# Altium schematic sheet 10_Gbit_Ethernet.SchDoc: Gbit_Ethernet
size 420 x 297 mm; Author: Lukas Henkel; DocumentNumber: 10; SheetNumber: 10; SheetTotal: 16; DocSize: A3
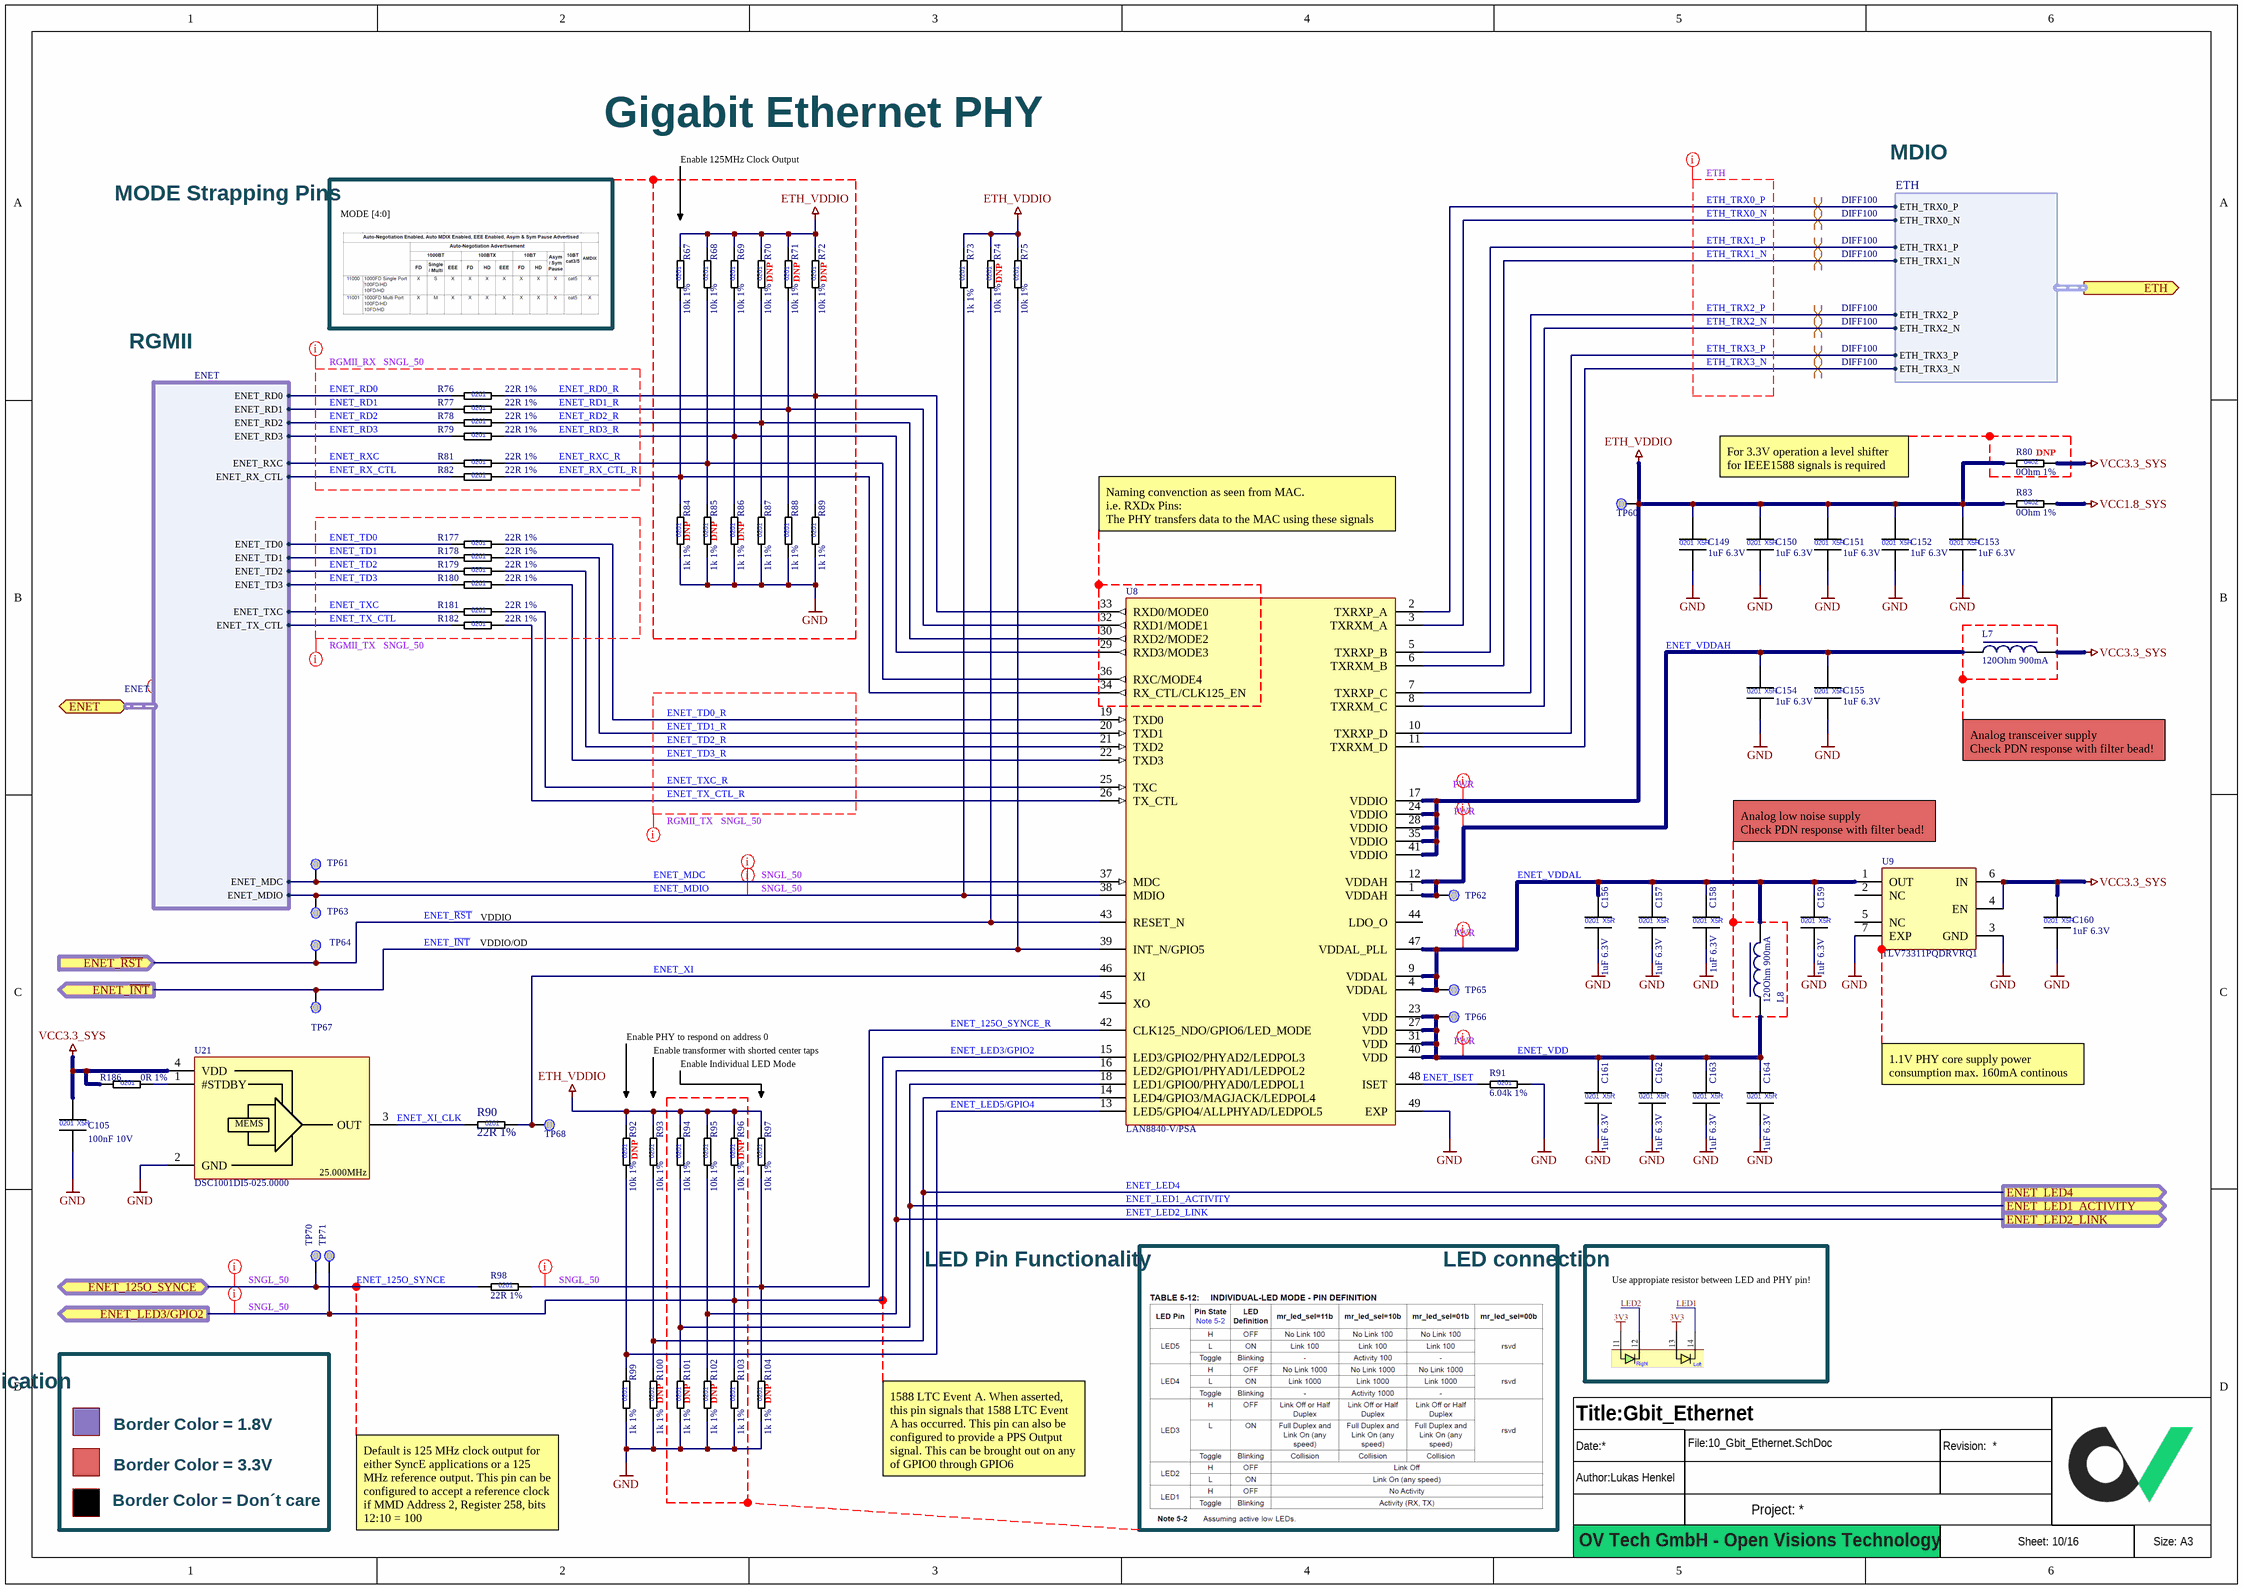
[diagram p0: 10_Gbit_Ethernet.SchDoc]

## Parts
?  (no value)  (graphical)
C105  100nF 10V  [CAPC0603X03L]
C149  1uF 6.3V  [CAPC0603X03L]
C150  1uF 6.3V  [CAPC0603X03L]
C151  1uF 6.3V  [CAPC0603X03L]
C152  1uF 6.3V  [CAPC0603X03L]
C153  1uF 6.3V  [CAPC0603X03L]
C154  1uF 6.3V  [CAPC0603X03L]
C155  1uF 6.3V  [CAPC0603X03L]
C156  1uF 6.3V  [CAPC0603X03L]
C157  1uF 6.3V  [CAPC0603X03L]
C158  1uF 6.3V  [CAPC0603X03L]
C159  1uF 6.3V  [CAPC0603X03L]
C160  1uF 6.3V  [CAPC0603X03L]
C161  1uF 6.3V  [CAPC0603X03L]
C162  1uF 6.3V  [CAPC0603X03L]
C163  1uF 6.3V  [CAPC0603X03L]
C164  1uF 6.3V  [CAPC0603X03L]
L7  120Ohm 900mA  [INDC0603X03L]
L8  120Ohm 900mA  [INDC0603X03L]
R67  10k 1%  [RESC0603X03L]
R68  10k 1%  [RESC0603X03L]
R69  10k 1%  [RESC0603X03L]
R70  10k 1%  [RESC0603X03L]
R71  10k 1%  [RESC0603X03L]
R72  10k 1%  [RESC0603X03L]
R73  1k 1%  [RESC0603X03L]
R74  10k 1%  [RESC0603X03L]
R75  10k 1%  [RESC0603X03L]
R76  22R 1%  [RESC0603X03L]
R77  22R 1%  [RESC0603X03L]
R78  22R 1%  [RESC0603X03L]
R79  22R 1%  [RESC0603X03L]
R80  0Ohm 1%  [RESC1005X04L]
R81  22R 1%  [RESC0603X03L]
R82  22R 1%  [RESC0603X03L]
R83  0Ohm 1%  [RESC1005X04L]
R84  1k 1%  [RESC0603X03L]
R85  1k 1%  [RESC0603X03L]
R86  1k 1%  [RESC0603X03L]
R87  1k 1%  [RESC0603X03L]
R88  1k 1%  [RESC0603X03L]
R89  1k 1%  [RESC0603X03L]
R90  22R 1%  [RESC0603X03L]
R91  6.04k 1%  [RESC0603X03L]
R92  10k 1%  [RESC0603X03L]
R93  10k 1%  [RESC0603X03L]
R94  10k 1%  [RESC0603X03L]
R95  10k 1%  [RESC0603X03L]
R96  10k 1%  [RESC0603X03L]
R97  10k 1%  [RESC0603X03L]
R98  22R 1%  [RESC0603X03L]
R99  1k 1%  [RESC0603X03L]
R100  1k 1%  [RESC0603X03L]
R101  1k 1%  [RESC0603X03L]
R102  1k 1%  [RESC0603X03L]
R103  1k 1%  [RESC0603X03L]
R104  1k 1%  [RESC0603X03L]
R177  22R 1%  [RESC0603X03L]
R178  22R 1%  [RESC0603X03L]
R179  22R 1%  [RESC0603X03L]
R180  22R 1%  [RESC0603X03L]
R181  22R 1%  [RESC0603X03L]
R182  22R 1%  [RESC0603X03L]
R186  0R 1%  [RESC0603X03L]
TP60  Testpoint 0.5mm  [TP_0.50mm]  (value not drawn)  (no BOM)
TP61  Testpoint 0.5mm  [TP_0.50mm]  (value not drawn)  (no BOM)
TP62  Testpoint 0.5mm  [TP_0.50mm]  (value not drawn)  (no BOM)
TP63  Testpoint 0.5mm  [TP_0.50mm]  (value not drawn)  (no BOM)
TP64  Testpoint 0.5mm  [TP_0.50mm]  (value not drawn)  (no BOM)
TP65  Testpoint 0.5mm  [TP_0.50mm]  (value not drawn)  (no BOM)
TP66  Testpoint 0.5mm  [TP_0.50mm]  (value not drawn)  (no BOM)
TP67  Testpoint 0.5mm  [TP_0.50mm]  (value not drawn)  (no BOM)
TP68  Testpoint 0.5mm  [TP_0.50mm]  (value not drawn)  (no BOM)
TP70  Testpoint 0.5mm  [TP_0.50mm]  (value not drawn)  (no BOM)
TP71  Testpoint 0.5mm  [TP_0.50mm]  (value not drawn)  (no BOM)
U8  LAN8840-V/PSA  [QFN50P700X700X100_HS-49L]
U9  TLV73311PQDRVRQ1  [SON65P200X80_HS-7L]
U21  DSC1001DI5-025.0000  [DFN165P250X90-4N]

## Blocks framed on the sheet
DNP: R80

## Ports
ENET (bidir, harness ENET), ENET_125O_SYNCE (bidir), ENET_LED1_ACTIVITY (out), ENET_LED2_LINK (out), ENET_LED3/GPIO2 (out), ENET_LED4 (out), ENET_~{INT} (out), ENET_~{RST} (in), ETH (out, harness ETH)

## Harnesses
ENET: ENET_MDC, ENET_MDIO, ENET_TX_CTL, ENET_TXC, ENET_TD0, ENET_TD1, ENET_TD2, ENET_TD3, ENET_RX_CTL, ENET_RXC, ENET_RD0, ENET_RD1, ENET_RD2, ENET_RD3
ETH: ETH_TRX0_P, ETH_TRX0_N, ETH_TRX1_N, ETH_TRX1_P, ETH_TRX2_P, ETH_TRX2_N, ETH_TRX3_P, ETH_TRX3_N

## Nets
ETH_VDDIO: C149.1 C150.1 C151.1 C152.1 C153.1 R67.2 R68.2 R69.2 R70.2 R71.2 R72.2 R73.2 R74.2 R75.2 R80.1 R83.1 R92.2 R93.2 R94.2 R95.2 R96.2 R97.2 TP60.TP U8.17(VDDIO) U8.24(VDDIO) U8.28(VDDIO) U8.35(VDDIO) U8.41(VDDIO)
GND: C105.2 C149.2 C150.2 C151.2 C152.2 C153.2 C154.2 C155.2 C156.2 C157.2 C158.2 C159.2 C160.2 C161.2 C162.2 C163.2 C164.2 R84.1 R85.1 R86.1 R87.1 R88.1 R89.1 R91.2 R99.1 R100.1 R101.1 R102.1 R103.1 R104.1 U8.49(EXP) U9.3(GND) U9.7(EXP) U21.2(GND)
VCC1.8_SYS: R83.2
VCC3.3_SYS: C105.1 C160.1 L7.2 R80.2 R186.1 U9.4(EN) U9.6(IN) U21.4(VDD)
ENET_125O_SYNCE: R98.1 TP70.TP ; port ENET_125O_SYNCE
ENET_125O_SYNCE_R: R97.1 R98.2 R104.2 U8.42(CLK125_NDO/GPIO6/LED_MODE)
ENET_~{INT}: R75.1 TP67.TP U8.39(INT_N/GPIO5) ; port ENET_~{INT}
ENET_ISET: R91.1 U8.48(ISET)
ENET_LED1_ACTIVITY: R94.1 R101.2 U8.18(LED1/GPIO0/PHYAD0/LEDPOL1) ; port ENET_LED1_ACTIVITY
ENET_LED2_LINK: R95.1 R102.2 U8.16(LED2/GPIO1/PHYAD1/LEDPOL2) ; port ENET_LED2_LINK
ENET_LED3/GPIO2: R96.1 R103.2 TP71.TP U8.15(LED3/GPIO2/PHYAD2/LEDPOL3) ; port ENET_LED3/GPIO2
ENET_LED4: R93.1 R100.2 U8.14(LED4/GPIO3/MAGJACK/LEDPOL4) ; port ENET_LED4
ENET_LED5/GPIO4: R92.1 R99.2 U8.13(LED5/GPIO4/ALLPHYAD/LEDPOL5)
ENET_MDC: TP61.TP U8.37(MDC) ; port ENET.ENET_MDC
ENET_MDIO: R73.1 TP63.TP U8.38(MDIO) ; port ENET.ENET_MDIO
ENET_~{RST}: R74.1 TP64.TP U8.43(RESET_N) ; port ENET_~{RST}
ENET_RD0: R76.1 ; port ENET.ENET_RD0
ENET_RD0_R: R72.1 R76.2 R89.2 U8.33(RXD0/MODE0)
ENET_RD1: R77.1 ; port ENET.ENET_RD1
ENET_RD1_R: R71.1 R77.2 R88.2 U8.32(RXD1/MODE1)
ENET_RD2: R78.1 ; port ENET.ENET_RD2
ENET_RD2_R: R70.1 R78.2 R87.2 U8.30(RXD2/MODE2)
ENET_RD3: R79.1 ; port ENET.ENET_RD3
ENET_RD3_R: R69.1 R79.2 R86.2 U8.29(RXD3/MODE3)
ENET_RX_CTL: R82.1 ; port ENET.ENET_RX_CTL
ENET_RX_CTL_R: R67.1 R82.2 R84.2 U8.34(RX_CTL/CLK125_EN)
ENET_RXC: R81.1 ; port ENET.ENET_RXC
ENET_RXC_R: R68.1 R81.2 R85.2 U8.36(RXC/MODE4)
ENET_TD0: R177.1 ; port ENET.ENET_TD0
ENET_TD0_R: R177.2 U8.19(TXD0)
ENET_TD1: R178.1 ; port ENET.ENET_TD1
ENET_TD1_R: R178.2 U8.20(TXD1)
ENET_TD2: R179.1 ; port ENET.ENET_TD2
ENET_TD2_R: R179.2 U8.21(TXD2)
ENET_TD3: R180.1 ; port ENET.ENET_TD3
ENET_TD3_R: R180.2 U8.22(TXD3)
ENET_TX_CTL: R182.1 ; port ENET.ENET_TX_CTL
ENET_TX_CTL_R: R182.2 U8.26(TX_CTL)
ENET_TXC: R181.1 ; port ENET.ENET_TXC
ENET_TXC_R: R181.2 U8.25(TXC)
ENET_VDD: C161.1 C162.1 C163.1 C164.1 L8.1 TP66.TP U8.23(VDD) U8.27(VDD) U8.31(VDD) U8.40(VDD)
ENET_VDDAH: C154.1 C155.1 L7.1 TP62.TP U8.1(VDDAH) U8.12(VDDAH)
ENET_VDDAL: C156.1 C157.1 C158.1 C159.1 L8.2 TP65.TP U8.4(VDDAL) U8.9(VDDAL) U8.47(VDDAL_PLL) U9.1(OUT)
ENET_XI: R90.2 TP68.TP U8.46(XI)
ENET_XI_CLK: R90.1 U21.3(OUT)
ETH_TRX0_N: U8.3(TXRXM_A) ; port ETH.ETH_TRX0_N
ETH_TRX0_P: U8.2(TXRXP_A) ; port ETH.ETH_TRX0_P
ETH_TRX1_N: U8.6(TXRXM_B) ; port ETH.ETH_TRX1_N
ETH_TRX1_P: U8.5(TXRXP_B) ; port ETH.ETH_TRX1_P
ETH_TRX2_N: U8.8(TXRXM_C) ; port ETH.ETH_TRX2_N
ETH_TRX2_P: U8.7(TXRXP_C) ; port ETH.ETH_TRX2_P
ETH_TRX3_N: U8.11(TXRXM_D) ; port ETH.ETH_TRX3_N
ETH_TRX3_P: U8.10(TXRXP_D) ; port ETH.ETH_TRX3_P
NetR186_2: R186.2 U21.1(#STDBY)

Not connected (* = marked no-connect by the designer): U8 44(LDO_O) 45(XO); U9 2(NC) 5(NC)

## Layout directives
net class ENET: (no net found under the mark)
net class ETH: ETH_TRX0_N, ETH_TRX0_P, ETH_TRX1_N, ETH_TRX1_P, ETH_TRX2_N, ETH_TRX2_P, ETH_TRX3_N, ETH_TRX3_P
differential pair; differential pair class DIFF100: ETH_TRX0_N, ETH_TRX0_P, ETH_TRX1_N, ETH_TRX1_P, ETH_TRX2_N, ETH_TRX2_P, ETH_TRX3_N, ETH_TRX3_P
net class RGMII_RX; net class SNGL_50; net class ENET: ENET_RD0, ENET_RD0_R, ENET_RD1, ENET_RD1_R, ENET_RD2, ENET_RD2_R, ENET_RD3, ENET_RD3_R, ENET_RX_CTL, ENET_RX_CTL_R, ENET_RXC, ENET_RXC_R
net class RGMII_TX; net class SNGL_50; net class ENET: ENET_TD0, ENET_TD0_R, ENET_TD1, ENET_TD1_R, ENET_TD2, ENET_TD2_R, ENET_TD3, ENET_TD3_R, ENET_TX_CTL, ENET_TX_CTL_R, ENET_TXC, ENET_TXC_R
net class SNGL_50: ENET_125O_SYNCE, ENET_125O_SYNCE_R, ENET_LED3/GPIO2, ENET_MDC, ENET_MDIO
net class PWR: ENET_VDD, ENET_VDDAH, ENET_VDDAL, ETH_VDDIO

## Notes on the sheet
- Gigabit Ethernet PHY
- MODE Strapping Pins
- Enable 125MHz Clock Output
- MDIO
- MODE [4:0]
- (near R70) DNP
- (near R71) DNP
- (near R72) DNP
- (near R74) DNP
- RGMII
- Naming convenction as seen from MAC.
  i.e. RXDx Pins:
  The PHY transfers data to the MAC using these signals
- For 3.3V operation a level shifter for IEEE1588 signals is required
- (near R84) DNP
- (near R85) DNP
- (near R86) DNP
- Analog transceiver supply
  Check PDN response with filter bead!
- (near U9) Analog low noise supply
  Check PDN response with filter bead!
- VDDIO
- VDDIO/OD
- Enable PHY to respond on address 0
- Enable transformer with shorted center taps
- Enable Individual LED Mode
- 1.1V PHY core supply power consumption max. 160mA continous
- (near R92) DNP
- (near R96) DNP
- LED Pin Functionality
- LED connection
- Use appropiate resistor between LED and PHY pin!
- Signal Level Indication
- (near R100) DNP
- (near R101) DNP
- (near R102) DNP
- (near R104) DNP
- Border Color = 1.8V
- Border Color = 3.3V
- 1588 LTC Event A. When asserted, this pin signals that 1588 LTC Event A has occurred. This pin can also be configured to provide a PPS Output signal. This can be brought out on any of GPIO0 through GPIO6
- Border Color = Don´t care
- Default is 125 MHz clock output for either SyncE applications or a 125 MHz reference output. This pin can be configured to accept a reference clock if MMD Address 2, Register 258, bits 12:10 = 100
- OV Tech GmbH - Open Visions Technology
- (in symbol CAP_0201_1uF_6.3V) 0201; X5R
- (in symbol CAP_0201_100nF_10V) 0201; X5R
- (in symbol MEMS Oscillator_Microchip_DSC1001DI5-025.0000) MEMS; 25.000MHz
- (in symbol RES_0201_0R_1%) 0201
- (in symbol RES_0201_1k_1%) 0201
- (in symbol RES_0201_6.04k_1%) 0201
- (in symbol RES_0201_10k_1%) 0201
- (in symbol RES_0201_22R_1%) 0201
- (in symbol RES_0402_0R_1%) 0402

## Library data of the parts
? = Titleblock_01_OpenSource
C105 = CAP_0201_100nF_10V: Multilayer Ceramic Capacitors MLCC - SMD/SMT 0201 10VDC; Manufacturer 1: Murata Electronics; Manufacturer 1 Prt. Nr.: GRT033R61A104KE01J; Manufacturer 2 Prt. Nr.: CL03A104MP3NNNC; Manufacturer 2: Samsung Electro-Mechanics
C149-C164 = CAP_0201_1uF_6.3V: Multilayer Ceramic Capacitors MLCC - SMD/SMT 0201 6.3VDC; Manufacturer 1: Murata Electronics; Manufacturer 1 Prt. Nr.: GRM033R60J105MEA2D; Manufacturer 2 Prt. Nr.: CL03A105MQ3CSNC; Manufacturer 2: Samsung Electro-Mechanics
L7 L8 = BEAD_0201_120Ohm_900mA: Ferrite Bead 0201 120Ohm 900mA; Manufacturer 1 Prt. Nr.: BLM03PX121SN1D; Manufacturer 1: Murata Electronics
R67-R72 R74 R75 R92-R97 = RES_0201_10k_1%: Thick Film Resistors - SMD 10K OHM 1%; Manufacturer 1: Yageo; Manufacturer 1 Prt. Nr.: RC0201FR-0710KL; Manufacturer 2 Prt. Nr.: CRCW020110K0FNED; Manufacturer 2: Vishay / Dale
R73 R84-R89 R99-R104 = RES_0201_1k_1%: Thick Film Resistors - SMD 1K OHM 1%; Manufacturer 1: Yageo; Manufacturer 1 Prt. Nr.: RC0201FR-071KL; Manufacturer 2 Prt. Nr.: CRCW02011K00FNED; Manufacturer 2: Vishay / Dale
R76-R79 R81 R82 R90 R98 R177-R182 = RES_0201_22R_1%: Thick Film Resistors - SMD 22R OHM 1%; Manufacturer 1: Yageo; Manufacturer 1 Prt. Nr.: RC0201FR-0722RL; Manufacturer 2 Prt. Nr.: CRCW020122R0FNED; Manufacturer 2: Vishay / Dale
R80 R83 = RES_0402_0R_1%: Thick Film Resistors - SMD 0OHM 1%; Manufacturer 1: Bourns; Manufacturer 1 Prt. Nr.: CR0402AJ/-000GAS; Manufacturer 2 Prt. Nr.: AC0402FR-070RL; Manufacturer 2: YAGEO
R91 = RES_0201_6.04k_1%: Thick Film Resistors - SMD 6.04K OHM 1%; Manufacturer 1: Yageo; Manufacturer 1 Prt. Nr.: RC0201FR-076K04L; Manufacturer 2 Prt. Nr.: CRCW02016K04FNED; Manufacturer 2: Vishay / Dale
R186 = RES_0201_0R_1%: Thick Film Resistors - SMD 0R OHM 1%; Manufacturer 1: Yageo; Manufacturer 1 Prt. Nr.: RC0201FR-070RL; Manufacturer 2 Prt. Nr.: CRCW02010000Z0ED; Manufacturer 2: Vishay / Dale
U8 = Ethernet Phy 1000Base_LAN8840-V/PSA: Precision IEEE1588v2 Integrated 10/100/1000M Ethernet precision Transdceiver; Manufacturer 1: Microchip Technology; Manufacturer 1 Prt. Nr.: LAN8840-V/PSA; Temperature Range: -40°C-105°C
U9 = LDO 1.1V_TLV73311PQDRVRQ1: LDO voltage regulator 300mA WSON-6; Manufacturer 1: Texas Instruments; Manufacturer 1 Prt. Nr.: TLV73311PQDRVRQ1; Temperature Range: -40°C-150°C
U21 = MEMS Oscillator_Microchip_DSC1001DI5-025.0000: 1.8V-3.3V Low-Power Precision CMOS Oscillators / Stability: ±10 ppm / Output load: 10pF; Manufacturer 1: Microchip Technology; Manufacturer 1 Prt. Nr.: DSC1001DI5-025.0000